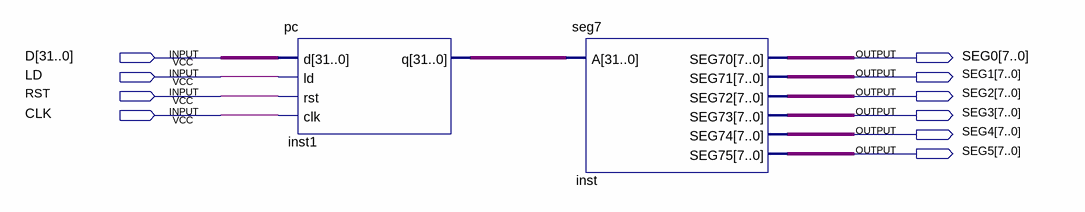
[diagram p0: schematic sheet]
// Quartus schematic SEG7Block.bdf as structural Verilog: 2 symbols, 10 pins
module SEG7Block (
  input  [31:0] D,
  input  LD,
  input  RST,
  input  CLK,
  output [7:0] SEG0,
  output [7:0] SEG1,
  output [7:0] SEG2,
  output [7:0] SEG3,
  output [7:0] SEG4,
  output [7:0] SEG5
);

  wire [31:0] inst1_q;

  pc inst1 (.d(D), .ld(LD), .rst(RST), .clk(CLK), .q(inst1_q));
  seg7 inst (.A(inst1_q), .SEG70(SEG0), .SEG71(SEG1), .SEG72(SEG2), .SEG73(SEG3), .SEG74(SEG4), .SEG75(SEG5));
endmodule
